# Altium project CP2102.PrjPcb
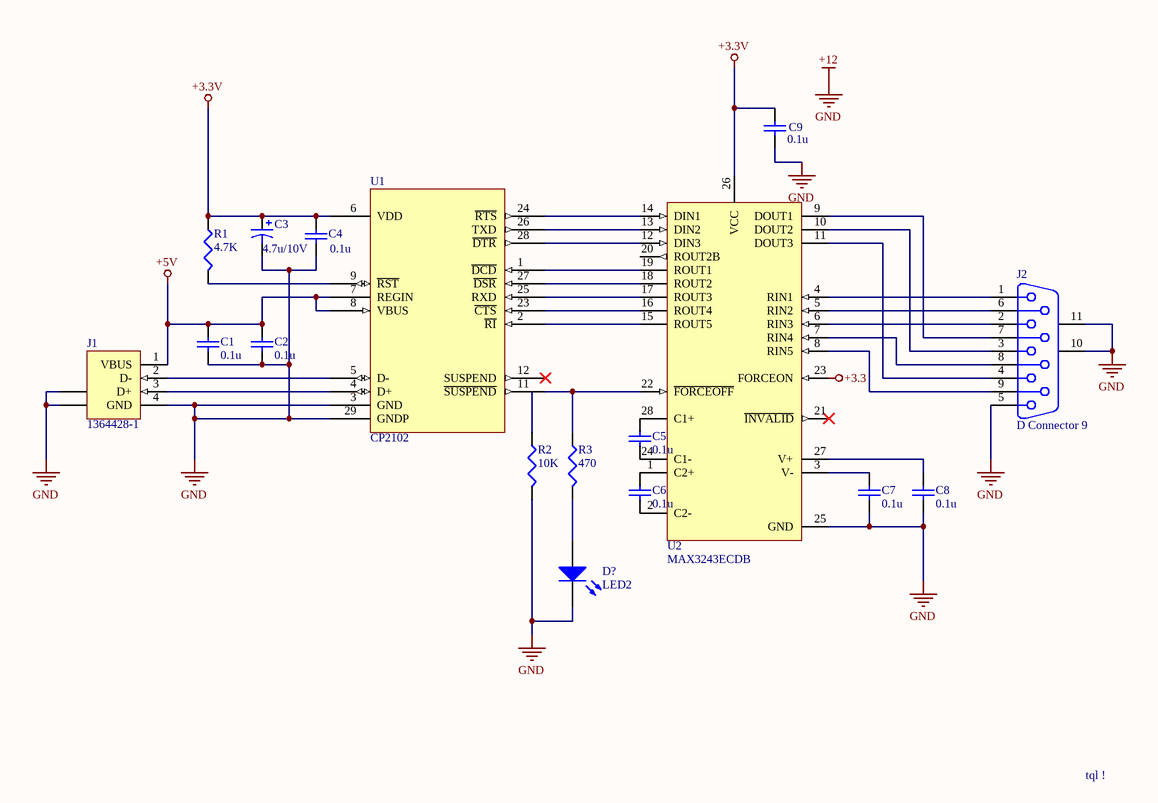
[diagram p0: Sheet1.SchDoc]
1 sheet, 17 parts. Net scope: global (net labels, ports and power ports of the same name join across sheets).

## Sheet Sheet1.SchDoc
size A4; SheetNumber: 1; SheetTotal: 1

### Parts
C1  value 0.1u  [C1206]  (hidden comment: Cap Semi)
C2  value 0.1u  [C1206]  (hidden comment: Cap Semi)
C3  value 4.7u/10V  [C0805]
C4  value 0.1u  [C1206]  (hidden comment: Cap Semi)
C5  value 0.1u  [C1206]  (hidden comment: Cap Semi)
C6  value 0.1u  [C1206]  (hidden comment: Cap Semi)
C7  value 0.1u  [C1206]  (hidden comment: Cap Semi)
C8  value 0.1u  [C1206]  (hidden comment: Cap Semi)
C9  value 0.1u  [C1206]  (hidden comment: Cap Semi)
D?  LED2  [3.2X1.6X1.1]
J1  1364428-1  [1364428]
J2  D Connector 9  [DSUB1.385-2H9]
R1  value 4.7K  [J1-0603]  (hidden comment: Res3)
R2  value 10K  [J1-0603]  (hidden comment: Res3)
R3  value 470  [J1-0603]  (hidden comment: Res3)
U1  CP2102
U2  MAX3243ECDB

### Nets
+3.3: U2.23(FORCEON)
+3.3V: C3.1 C4.2 C9.2 R1.1 U1.6(VDD) U2.26(VCC)
+5V: C1.2 C2.2 J1.1(VBUS) U1.7(REGIN) U1.8(VBUS)
+12: C1.1 C2.1 C3.2 C4.1 C7.1 C8.1 C9.1 D?.2(K) J1.4(GND) J1.5(SHLD) J1.6(SHLD) J2.5 J2.10(MH1) J2.11(MH2) R2.2 U1.3(GND) U1.29(GNDP) U2.25(GND)  [also labelled GND]
NetC5_1: C5.1 U2.24(C1-)
NetC5_2: C5.2 U2.28(C1+)
NetC6_1: C6.1 U2.2(C2-)
NetC6_2: C6.2 U2.1(C2+)
NetC7_2: C7.2 U2.3(V-)
NetC8_2: C8.2 U2.27(V+)
NetD?_1: D?.1(A) R3.2
NetJ1_2: J1.2(D-) U1.5(D-)
NetJ1_3: J1.3(D+) U1.4(D+)
NetJ2_1: J2.1 U2.4(RIN1)
NetJ2_2: J2.2 U2.6(RIN3)
NetJ2_3: J2.3 U2.10(DOUT2)
NetJ2_4: J2.4 U2.11(DOUT3)
NetJ2_6: J2.6 U2.5(RIN2)
NetJ2_7: J2.7 U2.9(DOUT1)
NetJ2_8: J2.8 U2.7(RIN4)
NetJ2_9: J2.9 U2.8(RIN5)
NetR1_2: R1.2 U1.9(~{RST})
NetR3_1: R3.1 U1.11(~{SUSPEND}) U2.22(~{FORCEOFF})
NetU1_1: U1.1(~{DCD}) U2.19(ROUT1)
NetU1_2: U1.2(~{RI}) U2.15(ROUT5)
NetU1_23: U1.23(~{CTS}) U2.16(ROUT4)
NetU1_24: U1.24(~{RTS}) U2.14(DIN1)
NetU1_25: U1.25(RXD) U2.17(ROUT3)
NetU1_26: U1.26(TXD) U2.13(DIN2)
NetU1_27: U1.27(~{DSR}) U2.18(ROUT2)
NetU1_28: U1.28(~{DTR}) U2.12(DIN3)

Not connected (* = marked no-connect by the designer): R2 1; U1 12(SUSPEND)*; U2 20(ROUT2B) 21(~{INVALID})*

### Notes on the sheet
- tql !

### Library data of the parts
C1 C2 C4-C9 = Cap Semi: Capacitor (Semiconductor SIM Model); Published: 8-Jun-2000; LatestRevisionDate: 29-May-2009; LatestRevisionNote: IPC-7351 Footprint Added.; PackageReference: C1206; Publisher: Altium Limited; PackageDescription: Chip Capacitor
C3 = Cap Pol3: Polarized Capacitor (Surface Mount); Published: 8-Jun-2000; LatestRevisionDate: 29-May-2009; LatestRevisionNote: IPC-7351 Footprint Added.; PackageReference: C0805; Publisher: Altium Limited; PackageDescription: Chip Capacitor
D? = LED2: Typical RED, GREEN, YELLOW, AMBER GaAs LED; Published: 8-Jun-2000; LatestRevisionDate: 17-Jul-2002; LatestRevisionNote: Re-released for DXP Platform.; PackageVersion: Feb-2002; PackageReference: 3.2X1.6X1.1; Publisher: Altium Limited; PackageDescription: SM LED; 2 Flat Leads
J1 = 1364428-1: USB 1.1, Vertical, Thru-Hole, A Type, Receptacle, 4 Position, Black; ContactMaterial: Copper Alloy; ContactPlating: Gold (30); TerminationLength: 2.79mm [0.110in.]; PCB_Layout: Complies with manufacturer's recommendation.; DrillSize: Corresponds to nominal value.; PanelGround: Without; Published: 15-Jul-2004; DatasheetDocument: 05-Jan-2004; PackageDocument: 05-Jan-2004; PackageReference: 1364428; Publisher: Altium Limited; HousingMaterial: Glass-Filled Thermoplastic; ComponentLink1Description: Manufacturer Link; ComponentLink1URL: http://www.tycoelectronics.com/; ComponentLink2Description: Packaging Specification; ComponentLink2URL: http://ecommas.tycoelectronics.com/commerce/DocumentDelivery/DDEController?Action=showdoc&DocId=Customer+Drawing%7F1364428%7FB%7Ftif%7FEnglish%7FENG_CD_1364428_B.tif
J2 = D Connector 9: Receptacle Assembly, 9 Position, Right Angle; PackageDocument: O; Positions: 9; Published: 15-Jun-2001; LatestRevisionDate: 17-Jul-2002; LatestRevisionNote: Re-released for DXP Platform.; DatasheetDocument: 1-Sep-1999; PackageReference: 788750; Publisher: Altium Limited; Orientation: Right Angle; Gender: Receptacle
R1-R3 = Res3: Resistor; Published: 8-Jun-2000; LatestRevisionDate: 29-May-2009; LatestRevisionNote: IPC-7351 Footprint Added.; PackageReference: J1-0603; Publisher: Altium Limited; PackageDescription: Chip Resistor
U2 = MAX3243ECDB: 3-V to 5.5-V Multichannel RS-232 Line Driver / Receiver with ?5-kV IEC ESD Protection, 0 to 70 degC, 28-Pin SSOP (DB), Green (RoHS & no Sb/Br); Drivers Per Package: 3; Receivers Per Package: 5; Supply Voltage(s)(V): 3.3 or 5.0; ESD HBM(kV): +/-15; ICC(Max)(mA): 1; Single Supply: TRUE; DatasheetVersion: SLLS657D; PackageVersion: revE, Dec-2001; PackageReference: DB28; PackageDescription: 28-Pin Plastic Small Outline Package, 10.2 x 5.3 mm Body, 0.65 mm Pitch; SubFamily: RS-232; RS-232: TRUE; IEC-61000-4-2 SUPPORT: TRUE; ComponentLink1Description: Manufacturer URL; ComponentLink1URL: www.ti.com; ComponentLink2Description: Datasheet; ComponentLink2URL: http://www.ti.com/general/docs/lit/getliterature.tsp?genericPartNumber=MAX3243E&fileType=pdf; ComponentLink3Description: Package Specification; ComponentLink3URL: http://www.ti.com/litv/pdf/msso002e